# EAGLE schematic MC34063A_step_up (EAGLE 6.2)
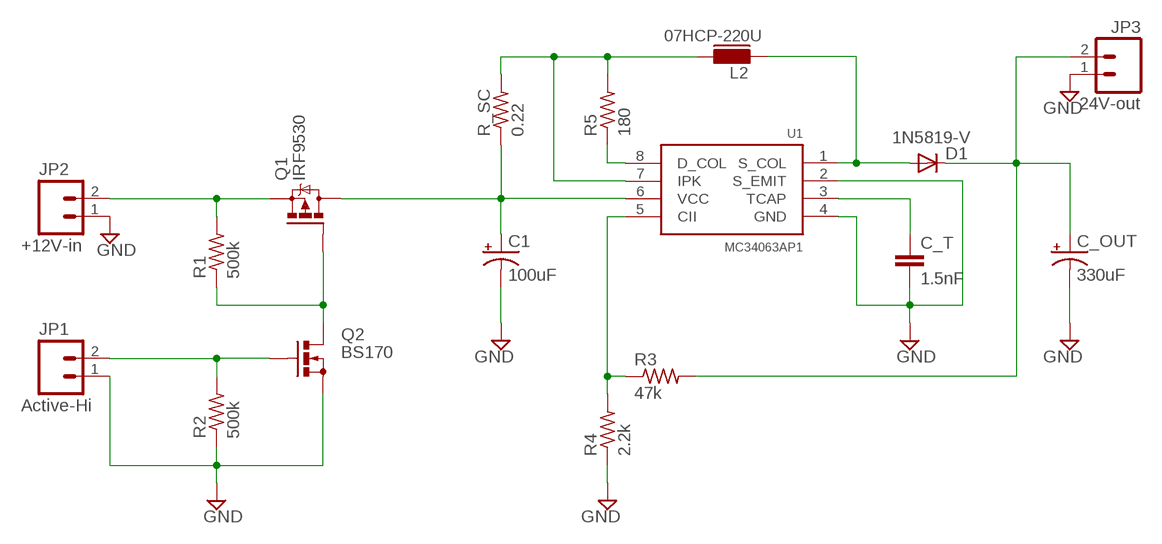
[diagram p0: schematic, sheet 1]

## Parts
C1  100uF  RCL_CPOL-USE5-10.5  [RCL_E5-10,5]
C_OUT  330uF  RCL_CPOL-USE5-10.5  [RCL_E5-10,5]
C_T  1.5nF  RCL_C-EU025-024X044  [RCL_C025-024X044]
D1  1N5819-V  [DO41-150V]
JP1  Active-Hi  M02PTH  [1X02]
JP2  +12V-in  M02PTH  [1X02]
JP3  24V-out  M02PTH  [1X02]
L2  07HCP-220U  [FASTRON_07HCP_INDUCTOR]
Q1  IRF9530  [TO220BV]
Q2  BS170  [TO92-]
R1  500k  RCL_R-US_0204/2V  [RCL_0204V]
R2  500k  RCL_R-US_0204/2V  [RCL_0204V]
R3  47k  RCL_R-US_0204/2V  [RCL_0204V]
R4  2.2k  RCL_R-US_0204/2V  [RCL_0204V]
R5  180  RCL_R-US_0204/2V  [RCL_0204V]
R_SC  0.22  RCL_R-US_0204/2V  [RCL_0204V]
U1  MC34063AP1  [DIL08]

## Nets
GND: C1.- C_OUT.- C_T.2 JP1.1 JP2.1 JP3.1 Q2.3(S) R2.1 R4.1 U1.2(S_EMIT) U1.4(GND)
N$1: D1.A L2.1 U1.1(S_COL)
N$2: JP2.2 Q1.S R1.2
N$3: Q1.G Q2.1(D) R1.1
N$4: JP1.2 Q2.2(G) R2.2
N$5: C_OUT.+ D1.C JP3.2
N$6: C_T.1 U1.3(TCAP)
N$7: R5.1 U1.8(D_COL)
N$8: L2.2 R5.2 R_SC.2 U1.7(IPK)
N$9: R3.1 R4.2 U1.5(CII)
N$10: C1.+ Q1.D R_SC.1 U1.6(VCC)
Unconnected: R3.2

## Library data of the parts
C1 C_OUT = ipas:RCL_CPOL-US: POLARIZED CAPACITOR, American symbol
C_T = ipas:RCL_C-EU: CAPACITOR, European symbol
D1 = ipas:1N5819: DIODE 1N5817 THRU 1N5819 1.0 AMP. Schottky Barrier Rectifiers Features Low forward voltage drop High current capability High reliability High surge current capability
JP1-JP3 = ipas:M02: Header 2 Standard 2-pin 0.1" header. Use with straight break away headers (SKU : PRT-00116), right angle break away headers (PRT-00553), swiss pins (PRT-00743), machine pins (PRT-00117), and female headers (PRT-00115). Molex polarized connector foot print use with SKU : PRT-08233 with associated crimp pins and housings.
L2 = _fastron_07HCP:07HCP-*: Fastron 07 HCP Series Inductors (Ferrite Core) (1 … 10000)uH, THT vertical assembly, 5 mm grid / 8.3 mm max. diameter / 10 mm max. height RoHS-Compliant Source: www.fastrongroup.co Technologies: 07HCP-… L/uH RDCmax/Ω IN/A Isat/A 1R0 1 0.06 7.5 10 2R2 2.2 0.01 6 8 3R3 3.3 0.013 5 6.3 4R7 4.7 0.018 4 5.4 6R8 6.8 0.025 3.8 6.5 100 10 0.04 2.6 5 220 22 0.055 2.3 3.6 470 47 0.1 1.3 2.5 680 68 0.14 1.1 2.1 820 82 0.16 1 1.9 101 100 0.19 0.9 1.6 121 120 0.22 0.85 1 221 220 0.38 0.64 1.2 331 330 0.7 0.51 0.85 471 470 0.89 0.43 0.8 821 820 1.56 0.36 0.7 102 1000 1.84 0.3 0.5 182 1800 3.3 0.21 0.35 103 10000 24 0.14 0.17 ±10% / ±20% fL = 1 kHz | 0.25 V Author: Dipl.-Ing. FH Rainer Bayer HHN Hochschule Heilbronn, rainer.bayer@hs-heilbronn.de Ingenieurbüro ing-rb, mail@ing-rb.de; FASTRON#: 07HCP-221
Q1 = transistor-power:IRF9530: P-CHANNEL HEXFET POWER-MOS-FET Source: http://www.irf.com/product-info/datasheets/data/irf9530.pdf
Q2 = ipas:BS170: N-CHANNEL MOS FET Small Signal MOSFET 500 mA, 60 Volts
R1-R5 R_SC = ipas:RCL_R-US_: RESISTOR, American symbol
U1 = ipas:MC34063A: MC34063A - 1.5A 3V-40V Boost/Buck/Inverting Voltage Regulator [Part No.] Allows you to 'boost', reduce or invert the voltage of your power supply to a more appropriate level. Common voltage regulators like the LM1117 are easy to use, but they can only 'reduce' the voltage level and require more volts than they provide, making them useless for low voltage power supplies like batteries or solar panels. A 'Step-Up' regulator like the MC34063A solves this problem by also allowing you to increase the voltage to a pre-determined level, though you still need to pay attention to the minimum voltage level the converter can handle, keeping in mind that many 'step-up' converts are less efficient at the two extreme ends of their working range. Given that many step-up circuits introduce some ripple to the power supply, you can often get a much 'smoother' supply by boosting the voltage up to 5.0V and then using a standard fixed voltage regulator (such as the common LM1117, etc.) to drop the voltage back down to 3.3V. This may not be necessary, and some step up regulators can provide a smooth supply on their own, but it's worth keeping in mind if you do encounter some ripple in the power supply using only a step-up IC for your power supply. Texas Instruments MC34063A Digikey: 296-17765-1-ND